# Altium schematic sheet power-breather.SchDoc
size A4; SheetNumber: 1; SheetTotal: 1
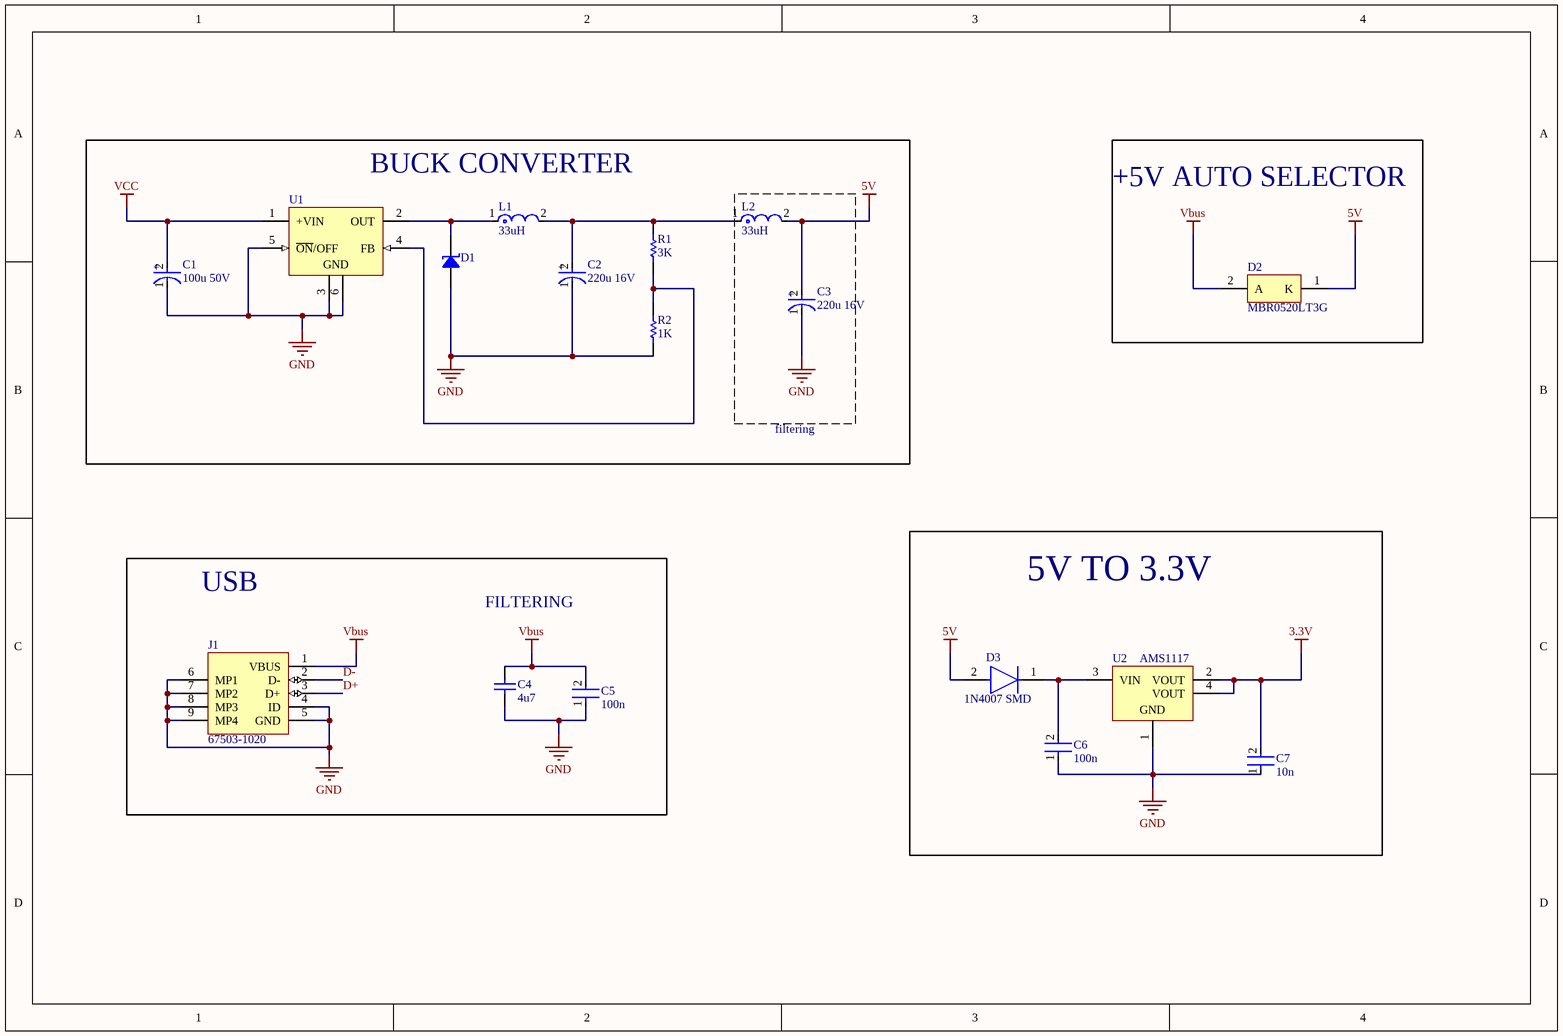
[diagram p0: power-breather.SchDoc]

## Parts
C1  100u 50V  [FP-UKA1H101MPD1TD-MFG]
C2  220u 16V  [FP-UKA1H101MPD1TD-MFG]
C3  220u 16V  [FP-UKA1H101MPD1TD-MFG]
C4  4u7  [CAPC2013X135X45NL10T25]
C5  100n  [FP-GRM188-0_1-e0_2_0_55-IPC_A]
C6  100n  [FP-GRM188-0_1-e0_2_0_55-IPC_A]
C7  10n  [FP-GRM188-0_1-e0_2_0_55-IPC_A]
D1  VTVS3V3GSMF-M3-08  [SMF DO-219AB]  (value not drawn)
D2  MBR0520LT3G  [ONSC-SOD-123-2-425-04_V]
D3  1N4007 SMD  [FP-1N4007_SMD-IPC_C]
J1  67503-1020  [MOLX-67503-1020_V]
L1  33uH  [FP-DEM10050C-MFG]
L2  33uH  [FP-DEM10050C-MFG]
R1  3K  [RESC2013X60X35ML10T20]
R2  1K  [RESC2013X60X35ML10T20]
U1  LM2596SX-ADJ/NOPB  [KTT0005B_L]  (value not drawn)
U2  AMS1117  [SOT-223_M]

## Blocks framed on the sheet
BUCK CONVERTER: C1-C3 D1 L1 L2 R1 R2 U1
+5V AUTO SELECTOR: D2
USB: C4 C5 J1
5V TO 3.3V: C6 C7 D3 U2

## Nets
3.3V: C7.2 U2.2(VOUT) U2.4(VOUT)
5V: C3.2(A) D2.1(K) D3.2(A) L2.2
GND: C1.1(C) C2.1(C) C3.1(C) C4.1 C5.1 C6.1 C7.1 D1.1 J1.4(ID) J1.5(GND) J1.6(MP1) J1.7(MP2) J1.8(MP3) J1.9(MP4) R2.1 U1.3(GND) U1.5(~{ON}/OFF) U1.6(GND) U2.1(GND)
Vbus: C4.2 C5.2 D2.2(A) J1.1(VBUS)
VCC: C1.2(A) U1.1(+VIN)
D+: J1.3(D+)
D-: J1.2(D-)
NetC2_2: C2.2(A) L1.2 L2.1 R1.2
NetC6_2: C6.2 D3.1(C) U2.3(VIN)
NetD1_2: D1.2 L1.1 U1.2(OUT)
NetR1_1: R1.1 R2.2 U1.4(FB)

## Notes on the sheet
- filtering
- FILTERING
- (in symbol CMP-12462-000027-1) +

## Library data of the parts
C1-C3 = CMP-12462-000027-1: CAP ALUM 100UF 20% 50V RADIAL; Life (Hours): 2000Hour; Ripple Current: 190mA; Leakage Current: 4uA; Termination: Radial; Mount: Through Hole; Length: 11.5mm; Series: KA; Case/Package: Radial; Package Quantity: 1; REACH SVHC: No SVHC; Height - Seated (Max): 0.512inch; Min Operating Temperature: -55°C; Packaging: Tape and Reel; Tolerance: 20%; Lead Pitch: 3.5mm; Voltage Rating (DC): 50V; Voltage Rating: 50V; Diameter: 8mm; Height: 11.5mm; Max Operating Temperature: 105°C; Capacitance: 100uF
C4 = CMP-2007-03607-1: Manufacturer: Murata; Part Number: GRM21BR72E103KW03L
C5-C7 = CMP-2006-02792-2: Chip Multilayer Ceramic Capacitors for General Purpose, 0603, 10uF, X5R, 15%, 20%, 6.3V; Packaging: Tape and Reel; Voltage Rating (DC): 6.3V; Width: 0.031inch; Termination: SMD/SMT; Dielectric: X5R; Package Quantity: 4000; Voltage Rating: 6.3V; Capacitance: 10uF; Case/Package: 0603; Min Operating Temperature: -55°C; Voltage: 6.3V; Length: 1.6mm; Thickness: 0.035inch; Lead Free: Lead Free; Depth: 0.8mm; Case Code (Imperial): 0603; Max Operating Temperature: 85°C; Material: Ceramic; Height: 0.8mm; Tolerance: 20%; Mount: Surface Mount; REACH SVHC: No SVHC; Radiation Hardening: No; Case Code (Metric): 1608
D1 = VTVS3V3GSMF-M3-08: ESD PROTECTION DIODE DO-219AB-M3; Manufacturer: Vishay Semiconductor Diodes Division; Capacitance @ Frequency: 2095pF @ 1MHz; Current - Peak Pulse (10/1000µs): 43.99A; Power Line Protection: No; Power - Peak Pulse: 400W; Type: Zener; Unidirectional Channels: 1; Voltage - Breakdown (Min): 6.57V; Voltage - Clamping (Max) @ Ipp: 8.9V; Voltage - Reverse Standoff (Typ): 3.3V; Part Number: VTVS3V3GSMF-M3-08; Applications: General Purpose; ComponentLink1Description: Datasheet; ComponentLink1URL: http://www.vishay.com/docs/85891/vtvs3v3asmf.pdf; ComponentLink2Description: DigiKey Link; ComponentLink2URL: http://digikey.com/product-detail/en/vishay-semiconductor-diodes-division/VTVS3V3GSMF-M3-08/VTVS3V3GSMF-M3-08GICT-ND/9467503; LastUpdated: 2/8/2024 9:51:14 PM; Lifecycle Status: Active; Minimum Order: 1; Mounting Type: Surface Mount; Operating Temperature: 175°C (TJ); Package / Case: DO-219AB; Packaging: TapeAndReel; PartId: 5497; Part Status: Active; Price: 0.21; Series: TransZorb®; Supplier 1: DigiKey; Supplier Part Number 1: VTVS3V3GSMF-M3-08GICT-ND; Supplier Device Package: DO-219AB (SMF)
D2 = CMP-1055-00408-1: Schottky Power Rectifier, 2-Pin SOD-123, Pb-Free, Tape and Reel; Manufacturer: On Semiconductor; Configuration: Single; IFSM Max (A): 5.5; PackageReference: SOD-123-2-425-04; ComponentLink3URL: http://www.onsemi.com/pub_link/Collateral/425-04.PDF; Mounting Technology: Surface Mount; PartNumber: MBR0520LT3G; ComponentLink1URL: http://www.onsemi.com/; ComponentLink1Description: Manufacturer URL; Packing: Tape and Reel; PackageDescription: 2-Pin SOD, Body 1.6 x 2.69 mm; ComponentLink2URL: http://www.onsemi.cn/pub_link/Collateral/MBR0520LT1-D.PDF; RoHS: TRUE; ComponentLink3Description: Package Specification; DatasheetVersion: Rev. 6; PackageVersion: Rev. G, 10/2009; ComponentLink2Description: Datasheet
D3 = CMP-12389-000001-1: Rectifier, 1Kv, 1A, Do-214Ac Rohs Compliant: Yes
J1 = CMP-0411-00002-1: USB, MINI, SMD, RA KME04-USBMU03A01; Manufacturer: Molex; ComponentLink1URL: http://www.molex.com/; PartNumber: 67503-1020; Mounting Technology: Surface Mount; ComponentLink1Description: Manufacturer URL; Terminal Pitch: 0.8 mm; DatasheetVersion: Rev F, 06/2009; ComponentLink2Description: Datasheet; PackageDescription: Mini USB Connector, SMT, Righer Angle; ComponentLink2URL: http://www.molex.com/pdm_docs/sd/675031020_sd.pdf; PackageReference: 67503-1020
L1 L2 = CMP-06042-015462-1: Shielded Wirewound Inductor 33uH 20% 2500mA 0.0936Ω SMD; Saturation Current: 3.5A; Core Material: Ferrite; Current Rating: 2.5A; Test Frequency: 100kHz; DC Resistance (DCR): 93.6mR; Inductance: 33uH; Mount: Surface Mount; Height - Seated (Max): 0.197inch; Length: 0.394inch; Shielding: Shielded; Resistor Type: Wirewound; Case/Package: SMD/SMT; Max DC Current: 2.5A; Width: 0.394inch; Number of Pins: 2; Tolerance: 20%; Packaging: Tape and Reel
R1 R2 = CMP-2100-03671-1: Chip Resistor, 1 KOhm, +/- 1%, 125 mW, -55 to 155 degC, 0805 (2012 Metric), RoHS, Tape and Reel; Manufacturer: Yageo; Temperature Coefficient: 100ppm/degreesC; Voltage Rating (DC): 150V; Max Power Dissipation: 125mW; Resistance: 1KOhm; Number of Pins: 2; Number of Terminations: 2; Datasheet URL: http://www.yageo.com/NewPortal/yageodocoutput?fileName=/pdf/R-Chip/PYu-RC_Group_51_RoHS_L_5.pdf; Length: 0.079inch; Package Description: 2-Pin Surface Mounted Device, Body 2 x 1.25 mm; Depth: 1.25mm; Height: 0.024inch; Military Standard: Not; Case/Package: 0805; Package Reference: 0805; RoHSCompliant: true; Lead Free: LeadFree; Packaging: TapeandReel; Package Quantity: 1; Datasheet Version: Rev. 5, 10/2016; Tolerance: 1%; Min Operating Temperature: -55degC; Voltage Rating: 150V; Composition: ThickFilm; Case Code (Imperial): 0805; Power Rating: 125mW; Width: 0.049inch; Case Code (Metric): 2012; Manufacturer URL: http://www.yageo.com/; Max Operating Temperature: 155degC; REACH SVHC: Unknown; Termination: SMD/SMT
U1 = CMP-2000-06545-1: Simple Switcher(R) Power Converter 150 kHz Step-Down Voltage Regulator, 3 A, 4.5 to 40 V, -40 to 125 degC, 5-Pin TO-263 (KTT), Green (RoHS & no Sb/Br), Tape and Reel; PartNumber: LM2596; Manufacturer: Texas Instruments; Package Version: 4200577-4/G, 01/2013; Primary Input Voltage: 40V; No. of Outputs: 1; No. of Pins: 5; SVHC: NoSVHC(19-Dec-2012); Output Voltage: 37V; Output Current: 3A; Datasheet Version: Rev. C, 04/2013; Package Reference: KTT5; MSL: MSL3-168hours; Number of Outputs: 1; Operating Temperature Min: -40°C; Operating Temperature Range: -40°Cto+125°C; Manufacturer URL: http://www.ti.com/; Package URL: http://www.ti.com/litv/pdf/mpsf007e; Voltage Regulator Case Style: TO-263; Operating Temperature Max: 125°C; Package Description: 5-Pin Plastic Flange Mount, Body 10.16 x 8.925 mm, Pitch 1.7 mm; Datasheet URL: http://www.ti.com/lit/ds/symlink/lm2596.pdf; Mounting Technology: SurfaceMount
U2 = CMP-0244-00316-1: 1A, Low Drop Positive Voltage Regulator, 3.3V, 4-Pin SOT-223, Tape and Reel; ComponentLink1Description: Manufacturer URL; DatasheetVersion: 2/12/2011; PackageVersion: 2010; ComponentLink1URL: http://www.st.com; ComponentLink2Description: Datasheet; ComponentLink2URL: http://www.st.com/internet/com/TECHNICAL_RESOURCES/TECHNICAL_LITERATURE/DATASHEET/CD00002116.pdf; PackageDescription: 4-Pin SOT-223 Package, 6.5 x 3.5 mm Body, 2.3 mm Pitch, 7 mm Lead Span; PackageReference: SOT-223